# Altium schematic sheet AnalogProject.SchDoc
size A4; SheetNumber: 1; SheetTotal: 1
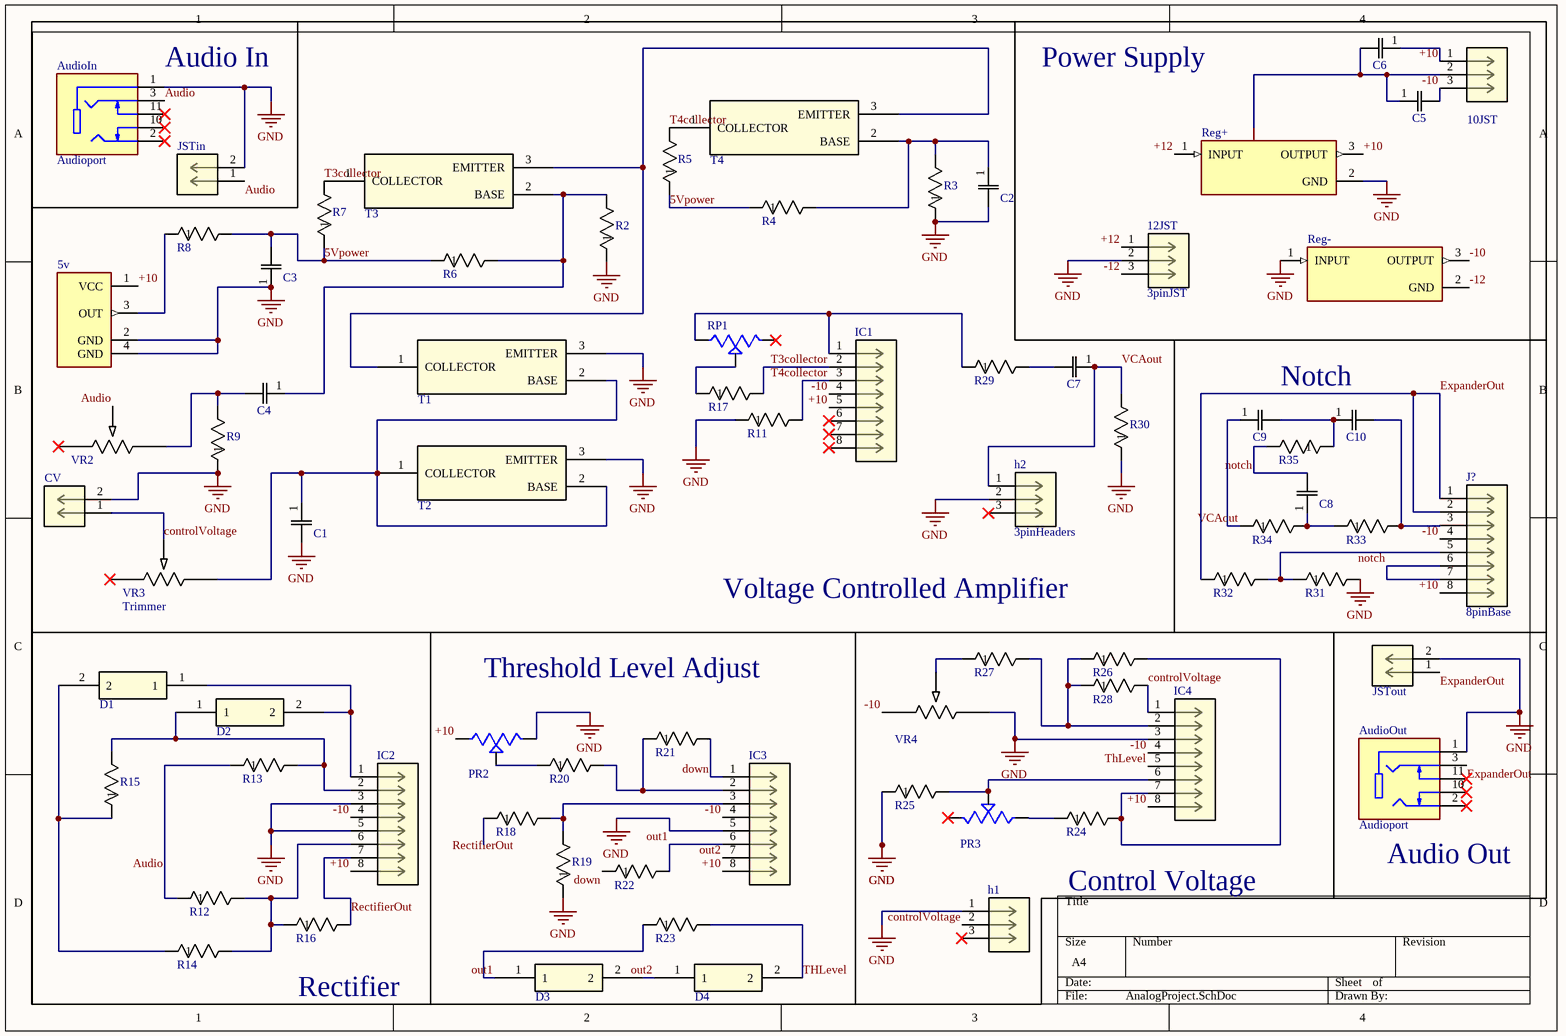
[diagram p0: AnalogProject.SchDoc]

## Parts
5v  amsRegulator  [SOT230P700X180-4N]  (value not drawn)
10JST  3pinJST  [CONN_B3B-XH-A_JST]  (value not drawn)
12JST  3pinJST  [CONN_B3B-XH-A_JST]
AudioIn  Audioport  [CUI_SJ1-3525N]
AudioOut  Audioport  [CUI_SJ1-3525N]
C1  capacitor  [CAP_YX_6P3X11_RUB]  (value not drawn)
C2  capacitor  [CAP_YX_6P3X11_RUB]  (value not drawn)
C3  capacitor  [CAP_YX_6P3X11_RUB]  (value not drawn)
C4  capacitor  [CAP_YX_6P3X11_RUB]  (value not drawn)
C5  capacitor  [CAP_YX_6P3X11_RUB]  (value not drawn)
C6  capacitor  [CAP_YX_6P3X11_RUB]  (value not drawn)
C7  capacitor  [CAP_YX_6P3X11_RUB]  (value not drawn)
C8  capacitor  [CAP_YX_6P3X11_RUB]  (value not drawn)
C9  capacitor  [CAP_YX_6P3X11_RUB]  (value not drawn)
C10  capacitor  [CAP_YX_6P3X11_RUB]  (value not drawn)
CV  2pinJST  [CONN_B2B-XH-A_JST]  (value not drawn)
D1  UF4007  [DO-41_FAS]  (value not drawn)
D2  UF4007  [DO-41_FAS]  (value not drawn)
D3  UF4007  [DO-41_FAS]  (value not drawn)
D4  UF4007  [DO-41_FAS]  (value not drawn)
h1  3pinHeaders  [CONN_M20-99903XX_HRW]  (value not drawn)
h2  3pinHeaders  [CONN_M20-99903XX_HRW]
IC1  4_PinSocket  [CONN8_1-2199298-2_TEC]  (value not drawn)
IC2  8pinBase  [CONN_A 08-LC-TT_ASM]  (value not drawn)
IC3  8pinBase  [CONN_A 08-LC-TT_ASM]  (value not drawn)
IC4  8pinBase  [CONN_A 08-LC-TT_ASM]  (value not drawn)
J?  8pinBase  [CONN_A 08-LC-TT_ASM]
JSTin  2pinJST  [CONN_B2B-XH-A_JST]  (value not drawn)
JSTout  2pinJST  [CONN_B2B-XH-A_JST]  (value not drawn)
PR2  roraryPotentiometer  [POT_PTN16-A01115K1A1]  (value not drawn)
PR3  roraryPotentiometer  [POT_PTN16-A01115K1A1]  (value not drawn)
R2  1/4W_Resistor  [STA_RNF14_STP]  (value not drawn)
R3  1/4W_Resistor  [STA_RNF14_STP]  (value not drawn)
R4  1/4W_Resistor  [STA_RNF14_STP]  (value not drawn)
R5  1/4W_Resistor  [STA_RNF14_STP]  (value not drawn)
R6  1/4W_Resistor  [STA_RNF14_STP]  (value not drawn)
R7  1/4W_Resistor  [STA_RNF14_STP]  (value not drawn)
R8  1/4W_Resistor  [STA_RNF14_STP]  (value not drawn)
R9  1/4W_Resistor  [STA_RNF14_STP]  (value not drawn)
R11  1/4W_Resistor  [STA_RNF14_STP]  (value not drawn)
R12  1/4W_Resistor  [STA_RNF14_STP]  (value not drawn)
R13  1/4W_Resistor  [STA_RNF14_STP]  (value not drawn)
R14  1/4W_Resistor  [STA_RNF14_STP]  (value not drawn)
R15  1/4W_Resistor  [STA_RNF14_STP]  (value not drawn)
R16  1/4W_Resistor  [STA_RNF14_STP]  (value not drawn)
R17  1/4W_Resistor  [STA_RNF14_STP]  (value not drawn)
R18  1/4W_Resistor  [STA_RNF14_STP]  (value not drawn)
R19  1/4W_Resistor  [STA_RNF14_STP]  (value not drawn)
R20  1/4W_Resistor  [STA_RNF14_STP]  (value not drawn)
R21  1/4W_Resistor  [STA_RNF14_STP]  (value not drawn)
R22  1/4W_Resistor  [STA_RNF14_STP]  (value not drawn)
R23  1/4W_Resistor  [STA_RNF14_STP]  (value not drawn)
R24  1/4W_Resistor  [STA_RNF14_STP]  (value not drawn)
R25  1/4W_Resistor  [STA_RNF14_STP]  (value not drawn)
R26  1/4W_Resistor  [STA_RNF14_STP]  (value not drawn)
R27  1/4W_Resistor  [STA_RNF14_STP]  (value not drawn)
R28  1/4W_Resistor  [STA_RNF14_STP]  (value not drawn)
R29  1/4W_Resistor  [STA_RNF14_STP]  (value not drawn)
R30  1/4W_Resistor  [STA_RNF14_STP]  (value not drawn)
R31  1/4W_Resistor  [STA_RNF14_STP]  (value not drawn)
R32  1/4W_Resistor  [STA_RNF14_STP]  (value not drawn)
R33  1/4W_Resistor  [STA_RNF14_STP]  (value not drawn)
R34  1/4W_Resistor  [STA_RNF14_STP]  (value not drawn)
R35  1/4W_Resistor  [STA_RNF14_STP]  (value not drawn)
Reg+  +10vregulator  [TO255P1020X450X1968-3B]  (value not drawn)
Reg-  +10vregulator  [TO255P1020X450X1968-3B]  (value not drawn)
RP1  roraryPotentiometer  [POT_PTN16-A01115K1A1]  (value not drawn)
T1  BC550  [TO-92-3L_5P33X5P2_ONS]  (value not drawn)
T2  BC550  [TO-92-3L_5P33X5P2_ONS]  (value not drawn)
T3  BC550  [TO-92-3L_5P33X5P2_ONS]  (value not drawn)
T4  BC550  [TO-92-3L_5P33X5P2_ONS]  (value not drawn)
VR2  Trimmer  [POT_3362P]  (value not drawn)
VR3  Trimmer  [POT_3362P]
VR4  Trimmer  [POT_3362P]  (value not drawn)

## Nets
GND: 5v.2(GND) 5v.4(GND) 10JST.2 12JST.2 AudioIn.1 AudioOut.1 C1.2 C2.2 C3.1 C5.1 C6.2 CV.2 h1.1 h2.2 IC2.3 IC2.5 IC3.5 IC4.3 JSTin.2 JSTout.2 PR2.3 R2.1 R3.1 R9.1 R11.1 R19.1 R25.1 R30.1 R31.2 Reg+.2(GND) Reg-.1(INPUT) T1.3(EMITTER) T2.3(EMITTER) VR4.3
5Vpower: C3.2 R4.1 R5.1 R6.1 R7.1 R8.2
+10: 5v.1(VCC) 10JST.1 C6.1 IC1.5 IC2.8 IC3.8 IC4.8 J?.8 PR2.1 Reg+.3(OUTPUT)
+12: 12JST.1 Reg+.1(INPUT)
-10: 10JST.3 C5.2 IC1.4 IC2.4 IC3.4 IC4.4 J?.4 Reg-.3(OUTPUT) VR4.1
-12: 12JST.3 Reg-.2(GND)
Audio: AudioIn.3 JSTin.1 R12.1 R13.1 VR2.2
controlVoltage: CV.1 h1.2 IC4.1 R28.2 VR3.2
down: IC3.1 R21.2 R22.1
ExpanderOut: AudioOut.3 J?.1 J?.2 JSTout.1 R32.1
notch: C8.2 J?.6 J?.7 R35.2
out1: D3.1 IC3.6 R22.2 R23.1
out2: D3.2 D4.1 IC3.7
RectifierOut: IC2.7 R16.2 R18.1
T3collector: IC1.2 R7.2 R17.2 T3.1(COLLECTOR)
T4collector: IC1.3 R5.2 R11.2 T4.1(COLLECTOR)
ThLevel: D4.2 IC4.5 R23.2
VCAout: C7.1 C9.1 h2.1 R30.2 R34.1
Net5v_3: 5v.3(OUT) R8.1
NetC1_1: C1.1 T1.2(BASE) T2.1(COLLECTOR) T2.2(BASE) VR3.3
NetC2_1: C2.1 R3.2 R4.2 T4.2(BASE)
NetC4_1: C4.1 R2.2 R6.2 T3.2(BASE)
NetC4_2: C4.2 R9.2 VR2.3
NetC7_2: C7.2 R29.2
NetC8_1: C8.1 R33.1 R34.2
NetC9_2: C9.2 C10.1 R35.1
NetC10_2: C10.2 J?.3 R33.2
NetD1_1: D1.1 D2.2 IC2.1
NetD1_2: D1.2 R14.1 R15.1
NetD2_1: D2.1 IC2.2 R13.2 R15.2
NetIC1_1: IC1.1 R29.1 RP1.1
NetIC2_6: IC2.6 R12.2 R14.2 R16.1
NetIC3_2: IC3.2 R20.2 R21.1
NetIC3_3: IC3.3 R18.2 R19.2
NetIC4_2: IC4.2 R26.1 R27.2 R28.1
NetIC4_6: IC4.6 PR3.2 R25.2
NetIC4_7: IC4.7 R24.2 R26.2
NetJ?_5: J?.5 R31.1 R32.2
NetPR2_2: PR2.2 R20.1
NetPR3_1: PR3.1 R24.1
NetR17_1: R17.1 RP1.2
NetR27_1: R27.1 VR4.2
NetT1_1: T1.1(COLLECTOR) T3.3(EMITTER) T4.3(EMITTER)

Not connected (* = marked no-connect by the designer): AudioIn 2* 10* 11*; AudioOut 2* 10* 11*; h1 3*; h2 3*; IC1 6* 7* 8*; PR3 3*; RP1 3*; VR2 1*; VR3 1*

## Notes on the sheet
- (near AudioIn) Audio In
- Power Supply
- Notch
- Voltage Controlled Amplifier
- Threshold Level Adjust
- Control Voltage
- (near AudioOut) Audio Out
- (near R16) Rectifier

## Library data of the parts
5v = amsRegulator: Temperature sensor [Smartec] SMT172-SOT-223 Temperature sensor; MP: SMT172-SOT223; MF: Smartec; Package: SOT-223-3 Smartec; Price: None; Value: *; SnapEDA_Link: https://www.snapeda.com/parts/SMT172-SOT223/Smartec/view-part/?ref=snap; Availability: Not in stock; Check_prices: https://www.snapeda.com/parts/SMT172-SOT223/Smartec/view-part/?ref=eda
10JST 12JST = 3pinJST: No Description Available; Mfr_Name: JST; RefDes: RefDes; Type: Type
AudioIn AudioOut = Audioport: 3.5 mm, Stereo, Right Angle, Through Hole, 3 Conductors, 2 Internal Switches, Audio Jack Connector; MF: CUI Devices; MP: SJ1-3525N; SnapEDA_Link: https://www.snapeda.com/parts/SJ1-3525N/CUI+Devices/view-part/?ref=snap; Package: None; Value: *; CUI_purchase_URL: https://www.cuidevices.com/product/interconnect/connectors/audio-connectors/jacks/sj1-3525n?utm_source=snapeda.com&utm_medium=referral&utm_campaign=snapedaBOM; Check_prices: https://www.snapeda.com/parts/SJ1-3525N/CUI+Devices/view-part/?ref=eda
C1 C2 C4 C7 = capacitor: 10u; Mfr_Name: Rubycon
C3 = capacitor: 220u; Mfr_Name: Rubycon
C5 C6 = capacitor: 33u; Mfr_Name: Rubycon
C8-C10 = capacitor: No Description Available; Mfr_Name: Rubycon
CV JSTin JSTout = 2pinJST: No Description Available; Mfr_Name: JST; RefDes: RefDes; Type: Type
D1-D4 = UF4007: No Description Available; Mfr_Name: onsemi / Fairchild Semiconductor; RefDes: RefDes; Type: Type
h1 h2 = 3pinHeaders: No Description Available; Mfr_Name: Harwin; RefDes: RefDes; Type: Type
IC1 = 4_PinSocket: No Description Available; Mfr_Name: TE Connectivity; TYPE: DIP; RefDes: RefDes
IC2-IC4 J? = 8pinBase: No Description Available; Mfr_Name: Assmann; RefDes: RefDes; Type: Type
PR2 = roraryPotentiometer: 10kohm; MF: {'manufacturer': u'CUI Devices'}; MP: PTN16-A01115K1A1; Package: None; Price: None; Value: *; Availability: Unavailable
PR3 = roraryPotentiometer: 20kohm; MF: {'manufacturer': u'CUI Devices'}; MP: PTN16-A01115K1A1; Package: None; Price: None; Value: *; Availability: Unavailable
R2-R4 R6 R30 = 1/4W_Resistor: 100kohm; Mfr_Name: Stackpole International
R5 R7 R9 R14 R17-R21 R24-R28 = 1/4W_Resistor: 1kohm; Mfr_Name: Stackpole International
R8 = 1/4W_Resistor: 10ohm; Mfr_Name: Stackpole International
R11 = 1/4W_Resistor: 10kohm; Mfr_Name: Stackpole International
R12 R13 R15 R16 R22 R23 = 1/4W_Resistor: 2kohm; Mfr_Name: Stackpole International
R29 = 1/4W_Resistor: 100ohm; Mfr_Name: Stackpole International
R31-R35 = 1/4W_Resistor: No Description Available; Mfr_Name: Stackpole International
Reg+ Reg- = +10vregulator: Linear Voltage Regulator IC Positive Fixed 1 Output 1.5A TO-220AB; MF: STMicroelectronics; MP: L7810CV; SnapEDA_Link: https://www.snapeda.com/parts/L7810CV/STMicroelectronics/view-part/?ref=snap; Package: TO-220-3 STMicroelectronics; Value: *; Check_prices: https://www.snapeda.com/parts/L7810CV/STMicroelectronics/view-part/?ref=eda
RP1 = roraryPotentiometer: 20Kohm; MF: {'manufacturer': u'CUI Devices'}; MP: PTN16-A01115K1A1; Package: None; Price: None; Value: *; Availability: Unavailable
T1-T4 = BC550: No Description Available; Mfr_Name: onsemi; RefDes: RefDes; Type: Type
VR2 = Trimmer: 100kohm; Mfr_Name: Bourns Electronics
VR3 = Trimmer: 10kohm; Mfr_Name: Bourns Electronics
VR4 = Trimmer: 1kohm; Mfr_Name: Bourns Electronics